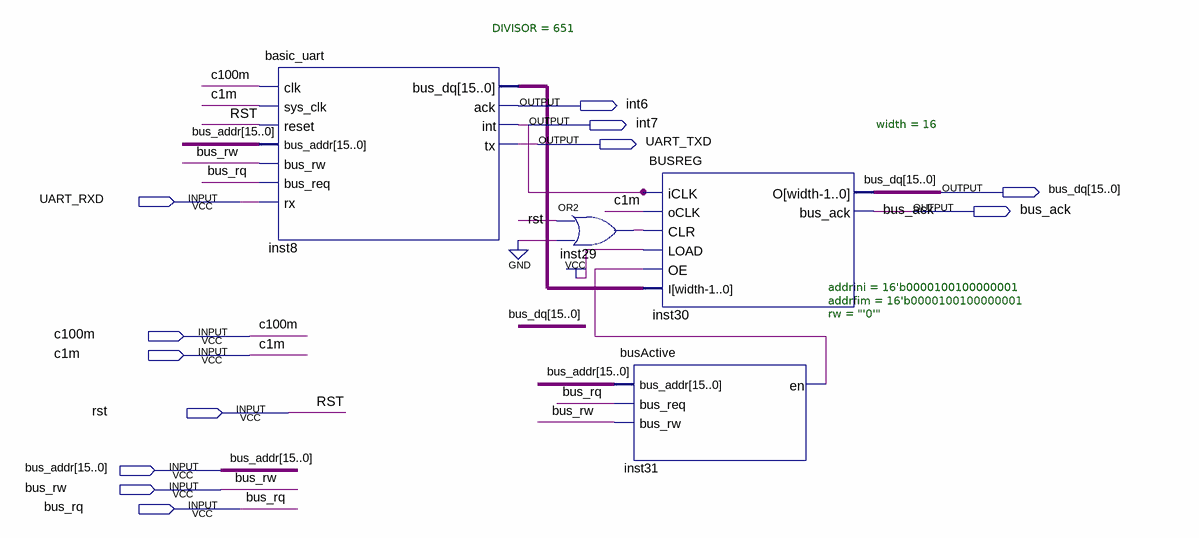
[diagram p0: schematic sheet]
// Quartus schematic uart.bdf as structural Verilog: 4 symbols, 12 pins
module uart (
  input  UART_RXD,
  input  c100m,
  input  c1m,
  input  rst,
  input  [15:0] bus_addr,
  input  bus_rw,
  input  bus_rq,
  output int6,
  output int7,
  output UART_TXD,
  output [15:0] bus_dq,
  output bus_ack
);

  wire inst29_out, inst31_en;
  wire [15:0] inst8_bus_dq;

  basic_uart #(.DIVISOR(651)) inst8 (
    .clk(c100m), .sys_clk(c1m), .reset(rst), .bus_addr(bus_addr), .bus_rw(bus_rw), .bus_req(bus_rq),
    .rx(UART_RXD), .ack(int6), .\int (int7), .tx(UART_TXD), .bus_dq(inst8_bus_dq));
  or inst29 (inst29_out, rst, 1'b0);
  BUSREG #(.width(16)) inst30 (
    .iCLK(int7), .oCLK(c1m), .CLR(inst29_out), .LOAD(1'b1), .OE(inst31_en), .I(inst8_bus_dq), .O(bus_dq),
    .bus_ack(bus_ack));
  busActive #(.addrini(16'b0000100100000001), .addrfim(16'b0000100100000001), .rw("'0'")) inst31 (
    .bus_addr(bus_addr), .bus_req(bus_rq), .bus_rw(bus_rw), .en(inst31_en));
endmodule
